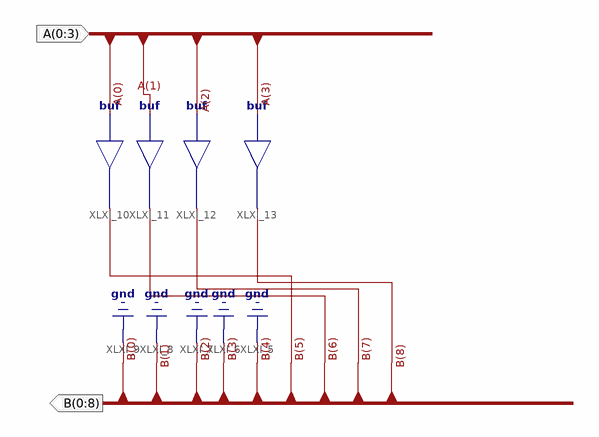
[diagram p0: schematic sheet 1]
// Xilinx ISE schematic bit4_bit9.sch (artix7) as structural Verilog: 4 symbols, 2 ports
module bit4_bit9 (
  input  [0:3] A,
  output [0:8] B
);

  buf XLXI_10 (B[5], A[0]);
  buf XLXI_11 (B[6], A[1]);
  buf XLXI_12 (B[7], A[2]);
  buf XLXI_13 (B[8], A[3]);

  assign B[0:4] = {5{1'b0}};
endmodule
